# EAGLE design cistercianDisplay (EAGLE 9.6.2)
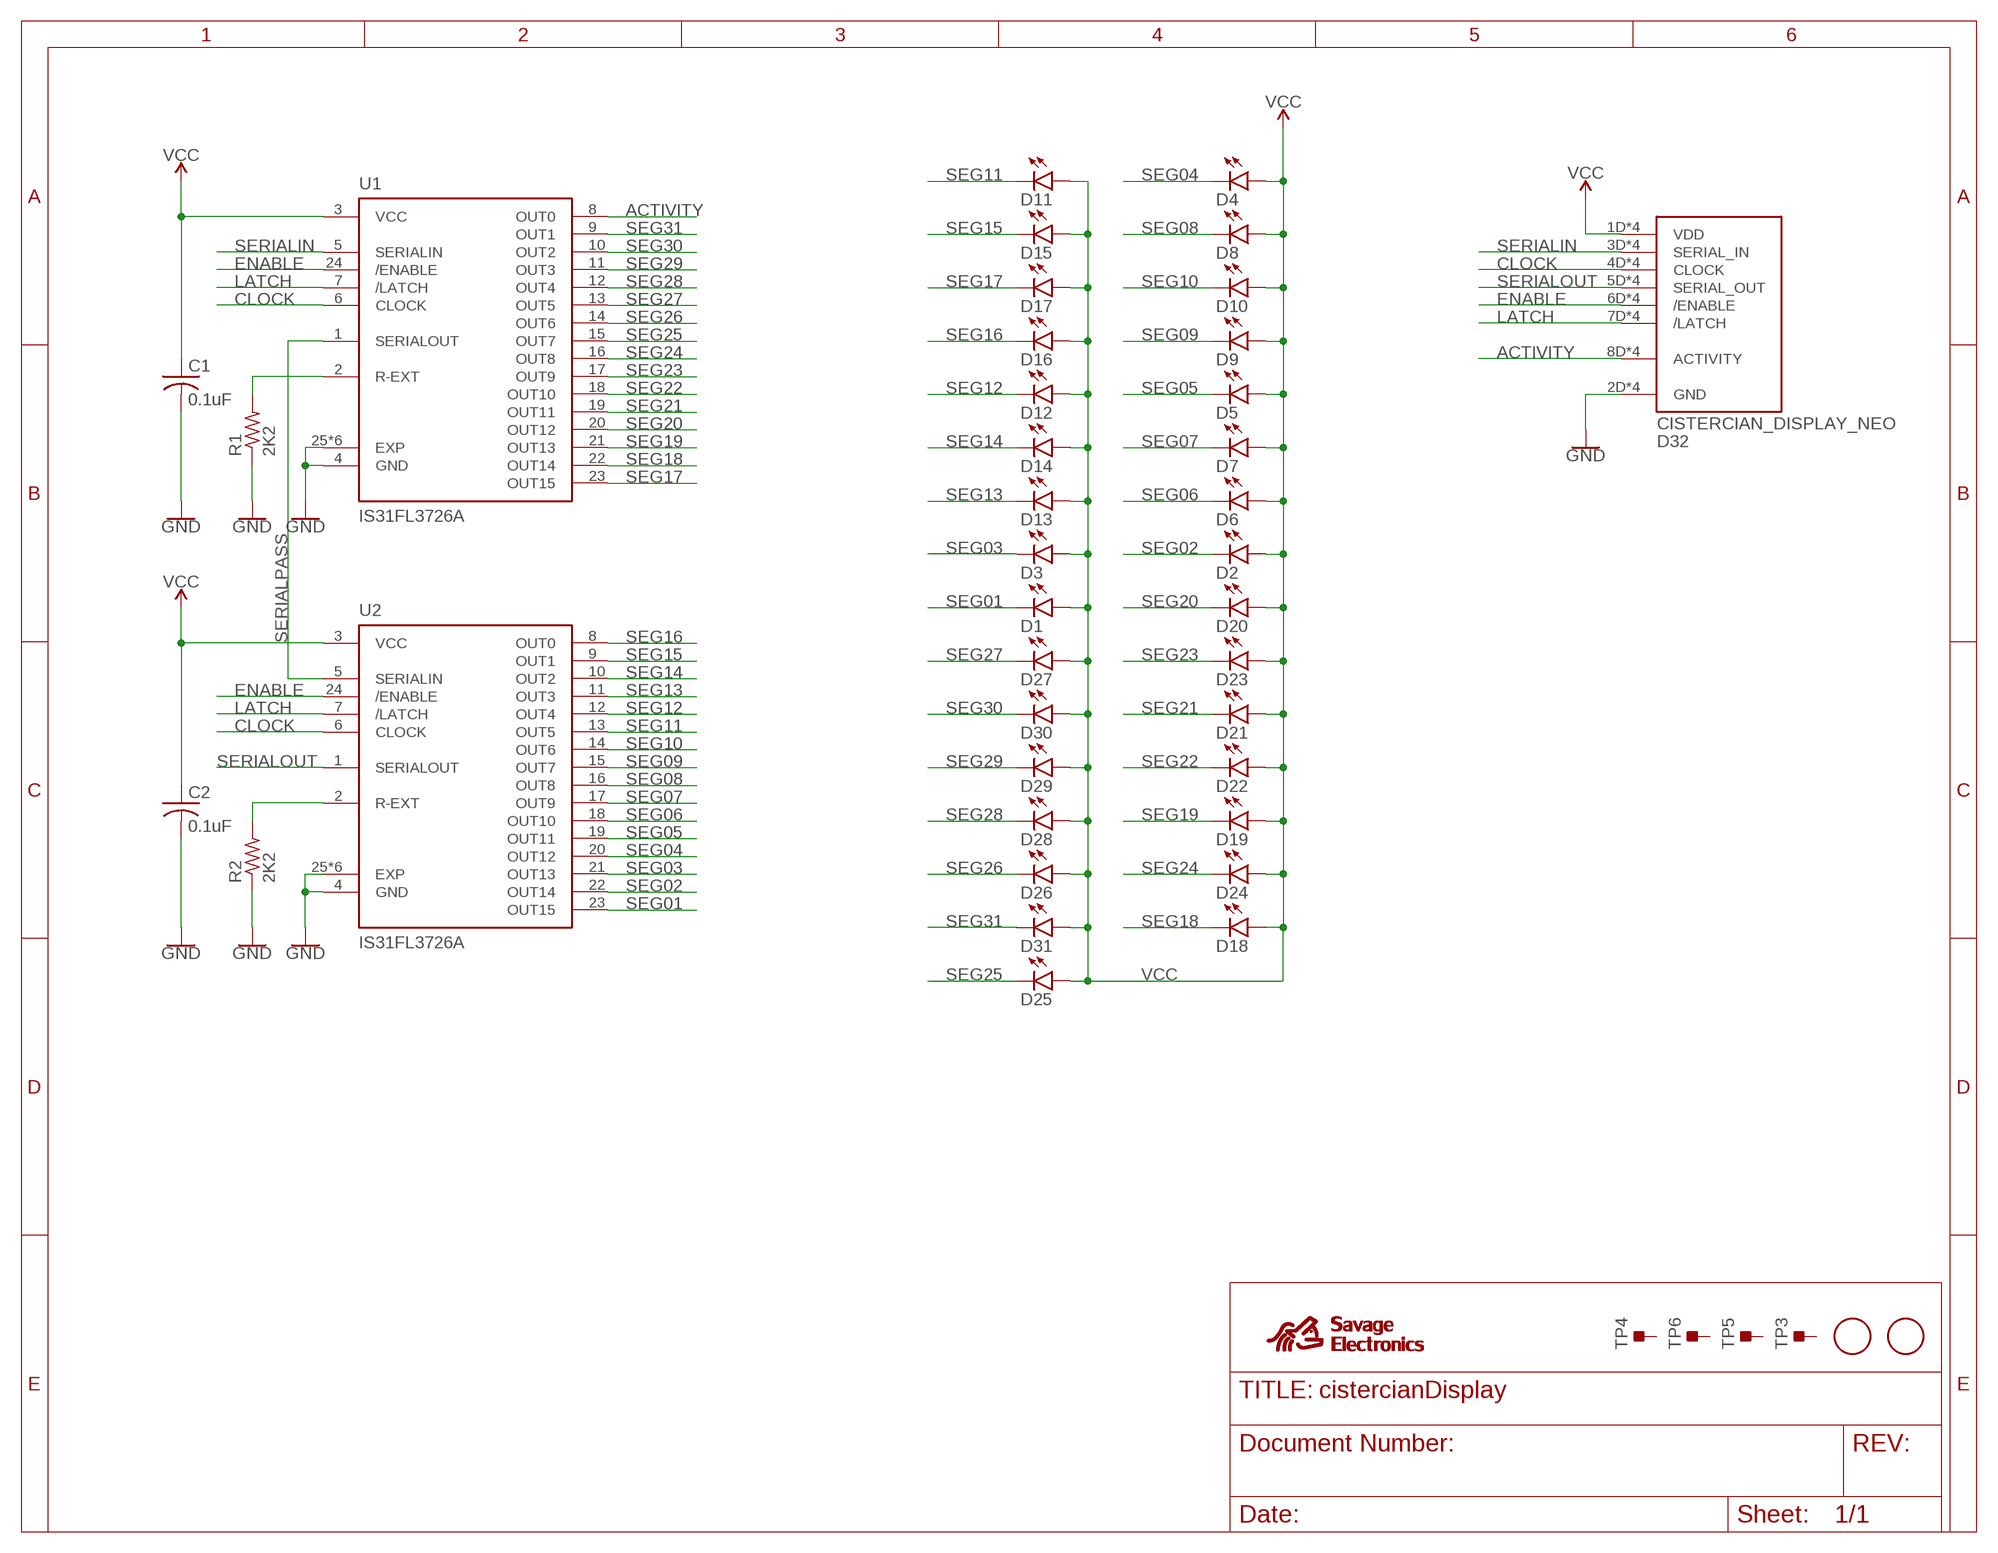
[diagram p0: schematic, sheet 1]

## Parts
C1  0.1uF  C-USC0603  [C0603]
C2  0.1uF  C-USC0603  [C0603]
D1  LEDCHIP-LED0805  [CHIP-LED0805]
D2  LEDCHIP-LED0805  [CHIP-LED0805]
D3  LEDCHIP-LED0805  [CHIP-LED0805]
D4  LEDCHIP-LED0805  [CHIP-LED0805]
D5  LEDCHIP-LED0805  [CHIP-LED0805]
D6  LEDCHIP-LED0805  [CHIP-LED0805]
D7  LEDCHIP-LED0805  [CHIP-LED0805]
D8  LEDCHIP-LED0805  [CHIP-LED0805]
D9  LEDCHIP-LED0805  [CHIP-LED0805]
D10  LEDCHIP-LED0805  [CHIP-LED0805]
D11  LEDCHIP-LED0805  [CHIP-LED0805]
D12  LEDCHIP-LED0805  [CHIP-LED0805]
D13  LEDCHIP-LED0805  [CHIP-LED0805]
D14  LEDCHIP-LED0805  [CHIP-LED0805]
D15  LEDCHIP-LED0805  [CHIP-LED0805]
D16  LEDCHIP-LED0805  [CHIP-LED0805]
D17  LEDCHIP-LED0805  [CHIP-LED0805]
D18  LEDCHIP-LED0805  [CHIP-LED0805]
D19  LEDCHIP-LED0805  [CHIP-LED0805]
D20  LEDCHIP-LED0805  [CHIP-LED0805]
D21  LEDCHIP-LED0805  [CHIP-LED0805]
D22  LEDCHIP-LED0805  [CHIP-LED0805]
D23  LEDCHIP-LED0805  [CHIP-LED0805]
D24  LEDCHIP-LED0805  [CHIP-LED0805]
D25  LEDCHIP-LED0805  [CHIP-LED0805]
D26  LEDCHIP-LED0805  [CHIP-LED0805]
D27  LEDCHIP-LED0805  [CHIP-LED0805]
D28  LEDCHIP-LED0805  [CHIP-LED0805]
D29  LEDCHIP-LED0805  [CHIP-LED0805]
D30  LEDCHIP-LED0805  [CHIP-LED0805]
D31  LEDCHIP-LED0805  [CHIP-LED0805]
D32  CISTERCIAN_DISPLAY_NEO  [CISTERCIAN_DISPLAYNEO]
R1  2K2  R-US_R0603  [R0603]
R2  2K2  R-US_R0603  [R0603]
TP3  TESTPOINT_TPS-SMD-10SN  [TESTPOINT_SMD-10SN]
TP4  TESTPOINT_TPS-SMD-10SN  [TESTPOINT_SMD-10SN]
TP5  TESTPOINT_TPS-SMD-10SN  [TESTPOINT_SMD-10SN]
TP6  TESTPOINT_TPS-SMD-10SN  [TESTPOINT_SMD-10SN]
U1  IS31FL3726A  [QFN50P400X400X90-25N]
U2  IS31FL3726A  [QFN50P400X400X90-25N]
U$1  FIDUCIAL  [FIDUCIAL_1MM]
U$2  FIDUCIAL  [FIDUCIAL_1MM]
U$3  SE_SMALL_STOP  [SE_SMALL_STOP]

## Nets
ACTIVITY: D32.8D(ACTIVITY) D32.8DC(ACTIVITY) D32.8U(ACTIVITY) D32.8UC(ACTIVITY) U1.8(OUT0)
CLOCK: D32.4D(CLOCK) D32.4DC(CLOCK) D32.4U(CLOCK) D32.4UC(CLOCK) U1.6(CLOCK) U2.6(CLOCK)
ENABLE: D32.6D(/ENABLE) D32.6DC(/ENABLE) D32.6U(/ENABLE) D32.6UC(/ENABLE) U1.24(/ENABLE) U2.24(/ENABLE)
GND: C1.2 C2.2 D32.2D(GND) D32.2DC(GND) D32.2U(GND) D32.2UC(GND) R1.1 R2.1 U1.4(GND) U1.25(EXP) U1.P$1(EXP) U1.P$2(EXP) U1.P$3(EXP) U1.P$4(EXP) U1.P$5(EXP) U2.4(GND) U2.25(EXP) U2.P$1(EXP) U2.P$2(EXP) U2.P$3(EXP) U2.P$4(EXP) U2.P$5(EXP)
LATCH: D32.7D(/LATCH) D32.7DC(/LATCH) D32.7U(/LATCH) D32.7UC(/LATCH) U1.7(/LATCH) U2.7(/LATCH)
N$39: R2.2 U2.2(R-EXT)
N$40: R1.2 U1.2(R-EXT)
SEG01: D1.C U2.23(OUT15)
SEG02: D2.C U2.22(OUT14)
SEG03: D3.C U2.21(OUT13)
SEG04: D4.C U2.20(OUT12)
SEG05: D5.C U2.19(OUT11)
SEG06: D6.C U2.18(OUT10)
SEG07: D7.C U2.17(OUT9)
SEG08: D8.C U2.16(OUT8)
SEG09: D9.C U2.15(OUT7)
SEG10: D10.C U2.14(OUT6)
SEG11: D11.C U2.13(OUT5)
SEG12: D12.C U2.12(OUT4)
SEG13: D13.C U2.11(OUT3)
SEG14: D14.C U2.10(OUT2)
SEG15: D15.C U2.9(OUT1)
SEG16: D16.C U2.8(OUT0)
SEG17: D17.C U1.23(OUT15)
SEG18: D18.C U1.22(OUT14)
SEG19: D19.C U1.21(OUT13)
SEG20: D20.C U1.20(OUT12)
SEG21: D21.C U1.19(OUT11)
SEG22: D22.C U1.18(OUT10)
SEG23: D23.C U1.17(OUT9)
SEG24: D24.C U1.16(OUT8)
SEG25: D25.C U1.15(OUT7)
SEG26: D26.C U1.14(OUT6)
SEG27: D27.C U1.13(OUT5)
SEG28: D28.C U1.12(OUT4)
SEG29: D29.C U1.11(OUT3)
SEG30: D30.C U1.10(OUT2)
SEG31: D31.C U1.9(OUT1)
SERIALIN: D32.3D(SERIAL_IN) D32.3DC(SERIAL_IN) D32.3U(SERIAL_IN) D32.3UC(SERIAL_IN) U1.5(SERIALIN)
SERIALOUT: D32.5D(SERIAL_OUT) D32.5DC(SERIAL_OUT) D32.5U(SERIAL_OUT) D32.5UC(SERIAL_OUT) U2.1(SERIALOUT)
SERIALPASS: U1.1(SERIALOUT) U2.5(SERIALIN)
VCC: C1.1 C2.1 D1.A D2.A D3.A D4.A D5.A D6.A D7.A D8.A D9.A D10.A D11.A D12.A D13.A D14.A D15.A D16.A D17.A D18.A D19.A D20.A D21.A D22.A D23.A D24.A D25.A D26.A D27.A D28.A D29.A D30.A D31.A D32.1D(VDD) D32.1DC(VDD) D32.1U(VDD) D32.1UC(VDD) U1.3(VCC) U2.3(VCC)
Unconnected: TP3.TP TP4.TP TP5.TP TP6.TP

## Library data of the parts
C1 C2 = Adafruit:C-US: CAPACITOR, American symbol
D1-D31 = Adafruit:LED: LED OSRAM: - CHIPLED LG R971, LG N971, LY N971, LG Q971, LY Q971, LO R971, LY R971 LH N974, LH R974 LS Q976, LO Q976, LY Q976 LO Q996 - Hyper CHIPLED LW Q18S LB Q993, LB Q99A, LB R99A - SideLED LS A670, LO A670, LY A670, LG A670, LP A670 LB A673, LV A673, LT A673, LW A673 LH A674 LY A675 LS A676, LA A676, LO A676, LY A676, LW A676 LS A679, LY A679, LG A679 - Hyper Micro SIDELED® LS Y876, LA Y876, LO Y876, LY Y876 LT Y87S - SmartLED LW L88C, LW L88S LB L89C, LB L89S, LG L890 LS L89K, LO L89K, LY L89K LS L896, LA L896, LO L896, LY L896 - TOPLED LS T670, LO T670, LY T670, LG T670, LP T670 LSG T670, LSP T670, LSY T670, LOP T670, LYG T670 LG T671, LOG T671, LSG T671 LB T673, LV T673, LT T673, LW T673 LH T674 LS T676, LA T676, LO T676, LY T676, LB T676, LH T676, LSB T676, LW T676 LB T67C, LV T67C, LT T67C, LS T67K, LO T67K, LY T67K, LW E67C LS E67B, LA E67B, LO E67B, LY E67B, LB E67C, LV E67C, LT E67C LW T67C LS T679, LY T679, LG T679 LS T770, LO T770, LY T770, LG T770, LP T770 LB T773, LV T773, LT T773, LW T773 LH T774 LS E675, LA E675, LY E675, LS T675 LS T776, LA T776, LO T776, LY T776, LB T776 LHGB T686 LT T68C, LB T68C - Hyper Mini TOPLED® LB M676 - Mini TOPLED Santana® LG M470 LS M47K, LO M47K, LY M47K Source: http://www.osram.convergy.de/
D32 = NRF52832PRO Footprint:CISTERCIAN_DISPLAY_NEO
R1 R2 = Adafruit:R-US_: RESISTOR, American symbol
TP3-TP6 = TestProbe_Long:TESTPOINT_TPS: TEST POINT PAD; BOM: EXCLUDE
U1 U2 = IS31FL3726A:IS31FL3726A: ARM Cortex-M0+ SAM D10D Microcontroller IC 32-Bit 48MHz 8KB (8K x 8) FLASH 24-QFN (4x4) Check availability <https://pricing.snapeda.com/parts/ATSAMD10D13A-MNT/Microchip/view-part?ref=eda>; AVAILABILITY: In Stock; DESCRIPTION: ARM® Cortex®-M0+ series Microcontroller IC 32-Bit Single-Core 48MHz 8KB (8K x 8) FLASH 24-QFN (4x4); MF: Microchip; MP: ATSAMD10D13A-MNT; PACKAGE: QFN-24 Microchip; PRICE: None; PURCHASE-URL: https://pricing.snapeda.com/search/part/ATSAMD10D13A-MNT/?ref=eda
U$1 U$2 = Adafruit:FIDUCIAL: For use by pick and place machines to calibrate the vision/machine, 1mm By microbuilder.eu
U$3 = SE_NEWLOGO:SE_SMALL_STOP

## Board
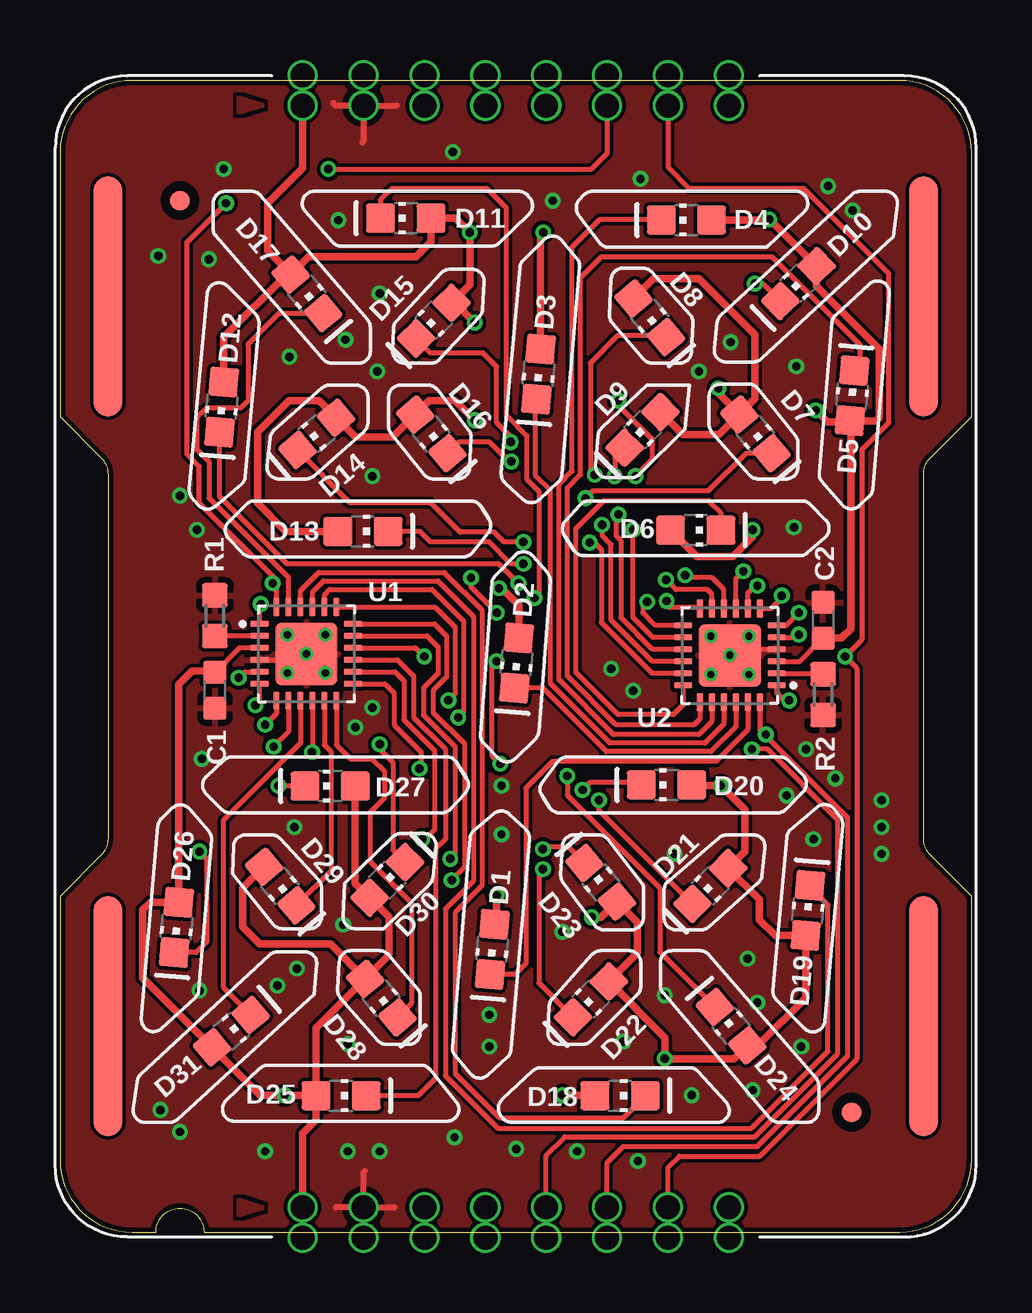
[diagram p1: board, top side]
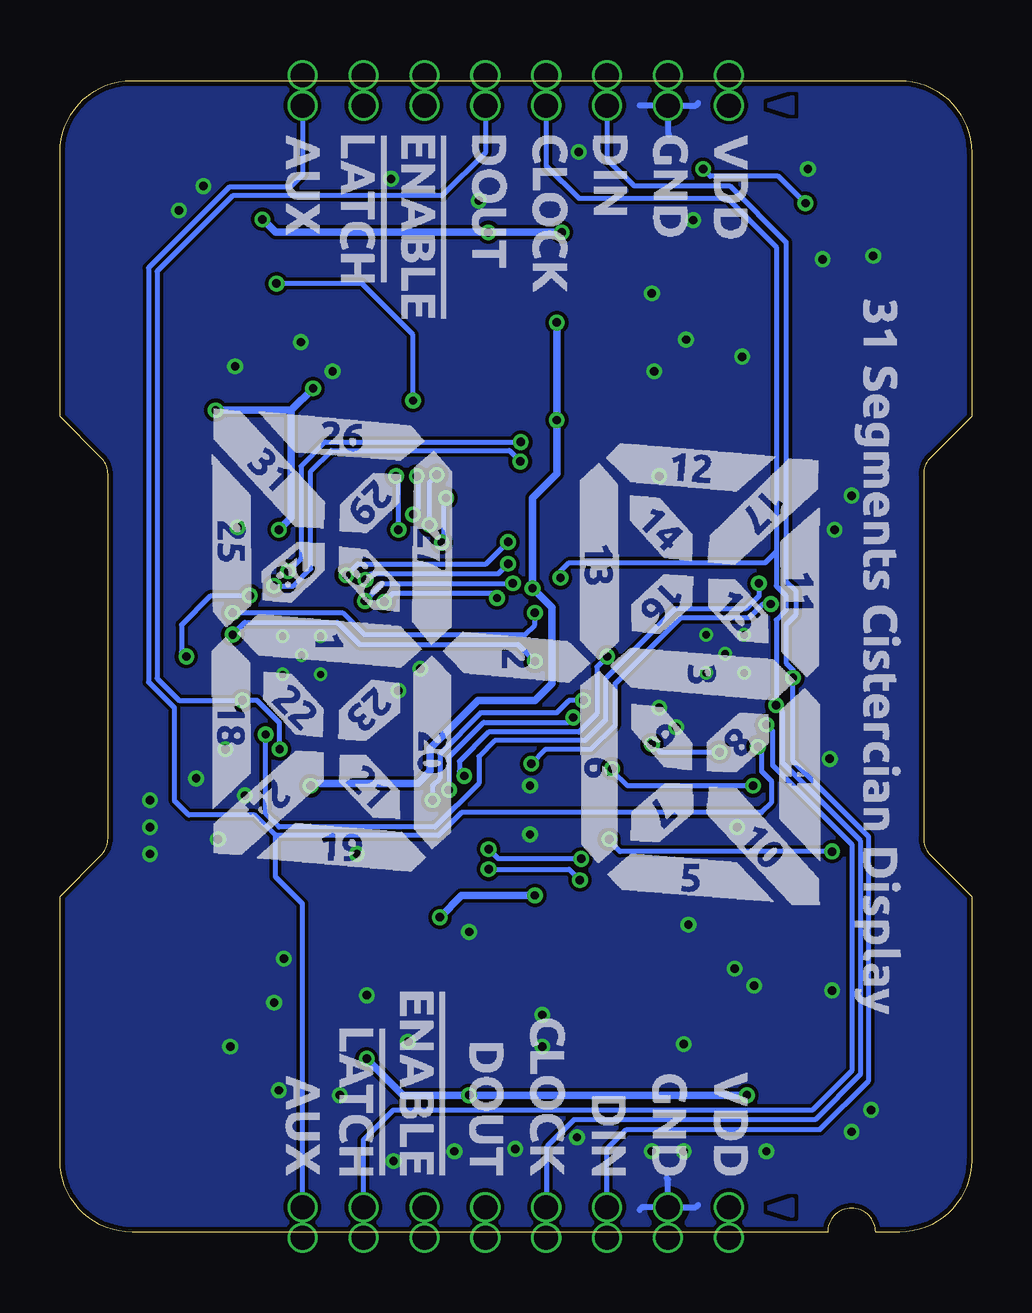
[diagram p2: board, bottom side, seen from below]

Size 38 x 48 mm. Coordinates in mm from the lower left corner, seen from the top.
Outline: 3,0 4,0 arc-90 5,1 arc-90 6,0 35,0 arc90 38,3 38,14 36.29,15.71 arc-45 36,16.41 36,31.59 arc-45 36.29,32.29 38,34 38,45 arc90 35,48 3,48 arc90 0,45 0,34 1.71,32.29 arc-45 2,31.59 2,16.41 arc-45 1.71,15.71 0,14 0,3 arc90 3,0
Copper layers (1*16): Top 0.035mm / dielectric 1.5mm / Bottom 0.035mm
Design rules "default *": minimum track width 6mil, minimum drill 0.3mm, track to track 6mil, track to pad 6mil, pad to pad 6mil, via to via 6mil, smd to smd 6mil, copper to edge 8mil, drill to drill 6mil, minimum pad ring 5mil, minimum via ring 6mil, stop-mask expansion 2mil, vias tented up to drill 20mil, thermal gap 10mil

### Footprints (pad centres in the part's own frame; a part is rotated, then mirrored left to right if it is on the bottom)
C0603 = smd 0.965 x 0.965: 1 -0.748,0; 2 0.748,0
CHIP-LED0805 = smd 1.2 x 1.2: A 0,-1.05; C 0,1.05
CISTERCIAN_DISPLAYNEO = drill 1: 1D -8.89,-22.962; 1DC -8.89,-24.232; 1U -8.89,24.232; 1UC -8.89,22.962; 2D -6.35,-22.962; 2DC -6.35,-24.232; 2U -6.35,24.232; 2UC -6.35,22.962; 3D -3.81,-22.962; 3DC -3.81,-24.232; 3U -3.81,24.232; 3UC -3.81,22.962; 4D -1.27,-22.962; 4DC -1.27,-24.232; 4U -1.27,24.232; 4UC -1.27,22.962; 5D 1.27,-22.962; 5DC 1.27,-24.232; 5U 1.27,24.232; 5UC 1.27,22.962; 6D 3.81,-22.962; 6DC 3.81,-24.232; 6U 3.81,24.232; 6UC 3.81,22.962; 7D 6.35,-22.962; 7DC 6.35,-24.232; 7U 6.35,24.232; 7UC 6.35,22.962; 8D 8.89,-22.962; 8DC 8.89,-24.232; 8U 8.89,24.232; 8UC 8.89,22.962
R0603 = smd 1 x 1.067: 1 -0.85,0; 2 0.85,0
TESTPOINT_SMD-10SN = smd 10 x 1.2: TP 0,0
QFN50P400X400X90-25N = smd 0.76 x 0.26: 1 -1.95,1.25; 2 -1.95,0.75; 3 -1.95,0.25; 4 -1.95,-0.25; 5 -1.95,-0.75; 6 -1.95,-1.25; 13 1.95,-1.25; 14 1.95,-0.75; 15 1.95,-0.25; 16 1.95,0.25; 17 1.95,0.75; 18 1.95,1.25 | smd 0.26 x 0.76: 7 -1.25,-1.95; 8 -0.75,-1.95; 9 -0.25,-1.95; 10 0.25,-1.95; 11 0.75,-1.95; 12 1.25,-1.95; 19 1.25,1.95; 20 0.75,1.95; 21 0.25,1.95; 22 -0.25,1.95; 23 -0.75,1.95; 24 -1.25,1.95 | smd 2.6 x 2.6: 25 0,0 | drill 0.3: P$1 -0.794,0.794; P$2 0.794,0.794; P$3 0.794,-0.794; P$4 -0.794,-0.794; P$5 0,0
FIDUCIAL_1MM = smd 0.813 x 0.813: 1 0,0

### Placement (x,y rotation side)
C1  6.46,22.59 270 top
C2  31.81,25.5 90 top
D1  18.02,11.79 175 top
D2  19.03,23.72 175 top
D3  19.95,35.76 175 top
D4  26.11,42.19 90 top
D5  33.02,34.86 355 top
D6  26.5,29.26 270 top
D7  28.99,33.27 220 top
D8  24.59,38.12 220 top
D9  24.28,33.44 135 top
D10  30.78,39.54 134 top
D11  14.41,42.27 90 top
D12  6.74,34.39 175 top
D13  12.63,29.21 270 top
D14  10.7,33.27 130 top
D15  15.58,38 135 top
D16  15.48,33.27 220 top
D17  10.3,39.12 220 top
D18  23.35,5.69 270 top
D19  31.18,13.41 355 top
D20  25.28,18.64 90 top
D21  27.11,14.43 135 top
D22  22.13,9.7 135 top
D23  22.54,14.58 40 top
D24  27.97,8.59 40 top
D25  11.72,5.69 270 top
D26  4.86,12.7 175 top
D27  11.26,18.59 90 top
D28  13.4,9.75 220 top
D29  9.18,14.43 220 top
D30  13.65,14.68 315 top
D31  7.15,8.38 310 top
D32  19,24 0 top
R1  6.46,25.69 270 top
R2  31.81,22.41 90 top
TP3  36,9 90 top
TP4  2,9 90 top
TP5  36,39 90 top
TP6  2,39 90 top
U1  10.27,24.11 0 top
U2  27.93,24.04 180 top
U$1  5,43 0 top
U$2  33,5 0 top
U$3  36,16 270 bottom

### Tracks (layer width: path | path; a pad name or v marks a point on that pad's centre or on a via)
ACTIVITY  (via drill 0.35)
  Top 0.203: U1.8 9.52,20.85 v8.91,20.23
  Top 0.254: D32.8UC D32.8U | D32.8D D32.8DC
  Bottom 0.203: v8.91,20.23 8.75,20.08 8.75,19.22 8.35,18.81 8.35,17.9 8.75,17.49 21.26,17.49 22.22,16.53 29.02,16.53 | D32.8UC 27.89,44.08 28.41,43.55 30.95,43.55 34.31,40.19 34.31,22.93 33.24,21.86 33.24,18 32.63,17.39 29.88,17.39 29.02,16.53 | 29.02,16.53 29.02,14.81 27.89,13.68 D32.8D
CLOCK  (via drill 0.35)
  Top 0.203: v8.14,21.96 8.32,22.14 U1.6 | U2.6 30.27,25.29 v30.8,25.82 | v18.2,25.82 17.14,26.88 v17.14,27.27
  Top 0.254: D32.4UC D32.4U | D32.4D D32.4DC
  Bottom 0.203: D32.4UC 17.73,44.45 16.37,43.09 10.18,43.09 8.14,41.06 8.14,28.36 | 8.14,28.36 8.14,26.94 7.74,26.53 7.74,25.92 8.14,25.52 v8.14,21.96 7.89,21.71 7.89,19.57 4.64,16.32 4.64,6.57 6.52,4.69 16.58,4.69 17.69,3.57 17.69,1.07 D32.4D | v30.8,25.82 26.23,25.82 25.31,24.91 18.61,24.91 18.2,25.31 v18.2,25.82 | v17.14,27.27 17.14,27.55 16.78,27.91 8.6,27.91 8.14,28.36
ENABLE  (via drill 0.35)
  Top 0.203: U2.24 29.18,20.94 29.33,20.79 | 29.33,20.79 32.83,17.29 32.83,7.33 29.07,3.57 23.49,3.57 22.81,2.9 D32.6D | U1.24 9.02,26.89 9.02,27.18 | v6.92,42.89 5.3,41.27 5.3,32.43 5.81,31.92 5.81,30.39 9.02,27.18 | v11.19,44.31 22.16,44.31 22.81,44.96 D32.6UC | v8.86,27.04 9.02,27.2 9.02,27.18 | v29.43,20.74 29.38,20.79 29.33,20.79
  Top 0.254: D32.6UC D32.6U | D32.6D D32.6DC
  Bottom 0.203: v6.92,42.89 8.04,44.01 10.89,44.01 v11.19,44.31 | v8.86,27.04 8.86,26.52 9.41,25.98 12.36,25.98 15.26,23.08 15.26,21.35 16.12,20.49 19.88,20.49 20.54,19.83 20.54,18.71 22.37,16.88 28.87,16.88 29.43,17.44 v29.43,20.74
GND  (via drill 0.35)
  Top 0.203: U1.4 10.02,23.86 U1.P$5 | U2.4 28.18,24.29 U2.P$5
  Top 0.254: D32.2UC 12.65,45.47 12.61,45.43 | D32.2UC 11.49,46.96 11.39,47.06 | D32.2UC 14.04,46.95 | D32.2D 12.65,2.49 12.72,2.56 | D32.2D 13.93,1.04 13.94,1.03 | D32.2D 11.5,1.03 | D32.2D D32.2DC
  Bottom 0.254: D32.2UC 12.65,45.77 12.61,45.74 | D32.2UC 11.49,46.96 11.39,47.06 | D32.2UC 13.83,46.95 | D32.2UC D32.2U | D32.2D 12.65,2.19 12.72,2.25 | D32.2D 13.73,1.04 13.83,0.93 | D32.2D 11.49,1.04 11.39,1.13
  other vias: 5.71,29.28 5.91,19.73 12.31,21.05 13.02,21.86 18.41,16.58 18.41,18.61 23.89,22.57 22.98,23.49 34.26,15.76 34.26,16.88 34.26,18 31.41,16.37 19.02,3.47 17.9,9.06 17.9,7.74 9.06,10.28 9.87,10.99 23.49,7.94 28.67,11.4 9.57,36.49 13.33,39.13 16.37,45.02 20.54,42.99 32.02,43.6 33.04,42.59 30.7,36.08 26.64,35.88 30.6,29.38 13.02,31.51 16.45,3.95 12,7.84 9.77,16.88 25.62,15.76 29.07,9.57 25.21,9.87 20.95,12.51 11.8,12.82 5.81,10.07 24.2,43.91 32.32,18.91 31.11,20.13 30.29,18.2 30.9,7.74 26.33,5.71 28.87,5.91 4.99,4.18 4.18,5.1 4.99,30.7 6.21,40.55 4.1,40.69 6.82,44.31 21.56,3.37 24.1,2.96 13.33,3.37 12,3.37 8.55,3.37 13.22,35.88 11.9,37.2 11.6,42.18 27.96,37.1
  pour Top (rank 2): 0,45 0,3 arc90 3,0 4,0 arc-90 5,1 arc-90 6,0 35,0 arc90 38,3 38,45 arc90 35,48 3,48 arc90
  pour Bottom (rank 2): 0,45 0,3 arc90 3,0 4,0 arc-90 5,1 arc-90 6,0 35,0 arc90 38,3 38,45 arc90 35,48 3,48 arc90
LATCH  (via drill 0.35)
  Top 0.203: U2.7 29.65,25.99 30.09,26.43 v30.09,26.53 | D32.7UC 25.35,44.38 26.23,43.5 31,43.5 34.56,39.95 34.56,33.75 33.44,32.63 33.44,24.7 v32.73,23.99 33.24,23.49 33.24,7.23 29.18,3.17 25.82,3.17 25.35,2.69 D32.7D | U1.7 9.02,21.62 v8.55,21.15
  Top 0.254: D32.7UC D32.7U | D32.7D D32.7DC
  Bottom 0.203: v32.73,23.99 32.93,24.2 32.93,25.31 31.71,26.53 v30.09,26.53 | v8.55,21.15 8.3,20.89 8.3,19.47 4.99,16.17 4.99,6.72 6.62,5.1 24.09,5.1 25.35,3.84 D32.7D
N$1
  pour Bottom: 7.47,46.65 7.47,47.3 8.46,46.97
  pour Top: 7.47,46.65 7.47,47.3 8.46,46.97
N$6
  pour Bottom: 7.47,0.7 7.47,1.35 8.46,1.02
  pour Top: 7.47,0.7 7.47,1.35 8.46,1.02
N$39
  Top 0.203: U2.2 31.77,23.29 R2.2
N$40
  Top 0.203: U1.2 6.47,24.86 R1.2
SEG01
  Top 0.203: U2.23 28.68,20.95 27.35,19.62 20.54,19.62 19.42,18.51 19.42,11.19 18.97,10.74 D1.C
SEG02
  Top 0.203: U2.22 28.18,21.06 27.14,20.03 22.77,20.03 20.13,22.68 D2.C
SEG03
  Top 0.203: U2.21 27.68,21.17 26.89,20.39 22.93,20.39 20.44,22.88 20.44,30.9 19.83,31.51 19.83,34.56 19.86,34.59 D3.C
SEG04
  Top 0.203: U2.20 27.18,21.28 26.64,20.74 23.08,20.74 20.79,23.03 20.79,31.16 21.35,31.72 21.35,41.06 22.5,42.22 25.04,42.22 D4.C
SEG05
  Top 0.203: U2.19 26.68,21.39 26.43,21.15 23.18,21.15 21.15,23.18 21.15,31.01 21.71,31.57 21.71,39.79 22.57,40.66 29.68,40.66 33.35,36.99 33.35,36.19 33.35,36.15 D5.C
SEG06
  Top 0.203: U2.18 25.98,21.98 25.57,21.57 23.26,21.57 21.5,23.33 21.5,29.33 22.67,30.5 27.04,30.5 27.55,29.99 D6.C
SEG07  (via drill 0.35)
  Top 0.203: U2.17 24.69,23.29 22.57,25.42 22.57,28.46 22.29,28.74 v22.09,28.74 | v21.91,30.6 22.21,30.9 27.04,30.9 28.61,32.47 D7.C
  Bottom 0.203: v21.91,30.6 22.01,30.5 22.01,28.82 v22.09,28.74
SEG08  (via drill 0.35)
  Top 0.203: U2.16 24.7,23.79 22.98,25.52 22.98,28.67 22.6,29.05 v22.6,29.48 | v22.29,31.56 22.11,31.74 22.11,36.23 23.25,37.37 25.22,37.37 25.22,37.35 D8.C
  Bottom 0.203: v22.6,29.48 22.6,31.26 v22.29,31.56
SEG09  (via drill 0.35)
  Top 0.203: U2.15 24.7,24.29 23.38,25.61 23.38,28.82 23.18,29.03 23.18,29.81 v23.28,29.91 | v23.13,31.51 23.13,32.29 D9.C
  Bottom 0.203: v23.28,29.91 23.08,30.12 23.08,31.46 v23.13,31.51
SEG10  (via drill 0.35)
  Top 0.203: U2.14 24.72,24.79 23.89,25.62 v23.89,29.28 | v23.99,31.51 24.7,32.22 24.7,33.04 23.28,34.46 v23.28,34.66 | v28.97,39.54 29.3,39.54 D10.C
  Bottom 0.203: v23.89,29.28 23.89,31.41 v23.99,31.51 | v23.28,34.66 23.28,37.41 25.42,39.54 v28.97,39.54
SEG11  (via drill 0.35)
  Top 0.203: U2.13 24.82,25.29 24.3,25.82 24.3,26.1 v24.47,26.28 | v19.78,26.43 19.98,26.63 19.98,30.86 19.47,31.37 19.47,33.19 18.61,34.05 18.61,42.69 17.8,43.5 13.83,43.5 13.36,43.03 D11.C
  Bottom 0.203: v19.78,26.43 19.98,26.64 24.12,26.64 v24.47,26.28
SEG12  (via drill 0.35)
  Top 0.203: U2.12 26.64,26.03 25.42,26.03 25.29,26.15 v25.29,26.3 | v19.12,27.04 18.3,27.85 9.46,27.85 6.65,30.67 D12.C
  Bottom 0.203: v25.29,26.3 24.55,27.04 v19.12,27.04
SEG13  (via drill 0.35)
  Top 0.203: U2.11 27.18,26.6 26.99,26.79 25.67,26.79 v25.26,27.19 | v19.32,27.85 18.81,27.85 17.9,28.77 15.45,28.77 15,29.21 D13.C
  Bottom 0.203: v25.26,27.19 25.01,27.45 19.73,27.45 v19.32,27.85
SEG14  (via drill 0.35)
  Top 0.203: U2.10 27.68,26.79 27.18,27.28 26.16,27.28 v26.06,27.38 | v19.32,28.77 18.51,28.77 18.1,29.18 16.68,29.18 15.46,30.39 12.1,30.39 D14.C
  Bottom 0.203: v26.06,27.38 25.59,27.85 20.23,27.85 v19.32,28.77
SEG15  (via drill 0.35)
  Top 0.203: U2.9 28.18,27.24 v28.49,27.55 | v18.79,32.93 18.79,33.16 18.2,33.75 18.2,36.08 17.64,36.65 15.45,36.65 D15.C
  Bottom 0.203: v28.49,27.55 27.96,28.08 27.96,31.92 26.94,32.93 v18.79,32.93
SEG16  (via drill 0.35)
  Top 0.203: U2.8 28.68,26.64 28.97,26.94 v29.07,26.94 | v18.81,32.12 18.71,32.12 17.9,32.93 16.62,32.93 D16.C
  Bottom 0.203: v29.07,26.94 28.26,26.94 27.55,27.65 27.55,31.72 26.69,32.58 19.27,32.58 v18.81,32.12
SEG17
  Top 0.203: U1.23 9.52,27.29 6.21,30.6 6.21,32.12 5.71,32.63 5.71,33.95 6.11,34.36 7.53,34.36 7.84,34.66 7.84,37.01 9.14,38.31 D17.C
SEG18
  Top 0.203: U1.22 10.02,26.73 10.79,27.5 16.02,27.5 17.59,25.92 17.59,14.44 16.48,13.33 16.48,6.62 18.32,4.78 23.49,4.78 D18.C
SEG19
  Top 0.203: U1.21 10.52,26.68 10.99,27.14 15.76,27.14 17.24,25.67 17.24,14.65 16.07,13.48 16.07,6.52 18.26,4.33 28.82,4.33 32.02,7.53 32.02,13.63 31.27,14.38 D19.C
SEG20  (via drill 0.35)
  Top 0.203: U1.20 11.02,26.57 11.24,26.79 15.52,26.79 16.83,25.47 16.83,21.68 v16.6,21.45 | v21.78,18.43 22.1,18.75 24.13,18.75 D20.C
  Bottom 0.203: v16.6,21.45 16.8,21.25 20.34,21.25 21.78,19.8 v21.78,18.43
SEG21  (via drill 0.35)
  Top 0.2: 16.48,24.7 16.48,22.44 v16.2,22.16 | 22.47,17.58 v22.47,18
  Top 0.203: U1.19 15.63,26.06 16.48,25.21 16.48,24.7 | D21.C 22.47,17.58
  Bottom 0.2: v16.2,22.16 16.78,22.16 17.29,21.66 20.44,21.66 22.16,19.93 22.16,18.91 22.47,18.61 v22.47,18
SEG22  (via drill 0.35)
  Top 0.2: U1.18 15.62,25.36 16.12,24.86 16.12,24.56 16.12,23.13 15.56,22.57 15.56,21.66 16.86,20.36 16.86,15.21 v16.33,14.67 | 19.97,10.38 19.97,14.96 v20.13,15.13
  Top 0.203: 19.97,10.38 D22.C
  Bottom 0.2: v16.33,14.67 16.78,15.13 v20.13,15.13
SEG23  (via drill 0.35)
  Top 0.2: U1.17 15.31,24.86 15.76,24.4 15.76,23.28 15.15,22.67 15.15,21.55 16.48,20.23 16.48,15.76 v16.27,15.56 | v20.13,15.97 20.23,16.07 21.18,16.07
  Top 0.203: 21.18,16.07 D23.C
  Bottom 0.2: v16.27,15.56 19.73,15.56 v20.13,15.97
SEG24  (via drill 0.35)
  Top 0.2: U1.16 14.82,24.36 v15.18,23.99 | v21.15,19.02 21.15,18.2 25.01,14.34 25.01,11.68
  Top 0.203: 25.01,11.68 D24.C
  Bottom 0.2: v15.18,23.99 15.62,23.56 15.62,21.6 16.37,20.84 20.13,20.84 21.35,19.62 21.35,19.22 v21.15,19.02
SEG25
  Top 0.2: U1.15 14.07,23.86 14.75,23.18 14.75,21.45 16.07,20.13 16.07,16.37 15.66,15.97 15.66,6.42 14.94,5.69
  Top 0.203: 14.94,5.69 D25.C
SEG26  (via drill 0.35)
  Top 0.2: U1.14 13.96,23.36 14.34,22.98 14.34,21.35 15.62,20.08 15.62,16.78 15.21,16.37 v15.11,16.37 | v5.81,15.87 6.11,15.56 6.11,12.08 5.68,11.65
  Top 0.203: 5.68,11.65 D26.C
  Bottom 0.2: v5.81,15.87 14.65,15.87 15.11,16.33 v15.11,16.37
SEG27  (via drill 0.35)
  Top 0.2: U1.13 13.55,22.86 13.94,22.47 13.94,21.15 15.06,20.02 15.06,19.52 15.04,19.5 15.04,19.37 v14.98,19.32
  Top 0.203: D27.C 9.12,18.59 v9.11,18.61
  Bottom 0.2: v14.98,19.32 14.98,19.25 14.34,18.61 v9.11,18.61
SEG28
  Top 0.2: U1.12 11.52,20.31 12.11,19.73 13.02,19.73 13.53,19.22 13.53,18.1 12.92,17.49 12.92,15.46 14.65,13.73 14.65,9.53
  Top 0.203: 14.65,9.53 D28.C
SEG29
  Top 0.2: U1.11 11.02,20.3 11.29,20.03 11.29,15.06
  Top 0.203: 11.29,15.06 D29.C
SEG30  (via drill 0.35)
  Top 0.2: U1.10 10.52,20.02 v10.51,20.01 | 13.88,15.93 13.88,19.57 13.33,20.13 v13.33,20.34
  Top 0.203: 13.88,15.93 D30.C
  Bottom 0.2: v10.51,20.01 12.99,20.01 v13.33,20.34
SEG31
  Top 0.2: U1.9 10.02,20.38 6.82,17.19 6.82,10.19
  Top 0.203: D31.C 6.82,10.19
SERIALIN  (via drill 0.35)
  Top 0.203: v7.45,23.11 7.7,23.36 U1.5
  Top 0.254: D32.3UC D32.3U | D32.3D D32.3DC
  Bottom 0.203: D32.3UC 15.19,44.73 14.07,43.61 10.08,43.61 7.74,41.27 7.74,27.14 7.33,26.74 7.33,25.72 7.74,25.31 7.74,23.73 7.45,23.43 v7.45,23.11 7.45,19.64 4.28,16.48 4.28,6.32 6.32,4.28 14.38,4.28 15.19,3.47 D32.3D
SERIALOUT  (via drill 0.35)
  Top 0.203: v30.39,22.16 30.19,22.16 29.88,22.48 U2.1 | D32.5D 20.27,3.2 21.05,3.98 28.97,3.98 32.43,7.43 32.43,17.19 29.48,20.13 v28.84,20.13
  Top 0.254: D32.5UC D32.5U | D32.5D D32.5DC
  Bottom 0.203: D32.5UC 20.27,44.99 22.06,43.2 30.8,43.2 33.95,40.05 33.95,23.08 33.04,22.16 v30.39,22.16 29.79,22.16 28.84,21.23 v28.84,20.13
SERIALPASS  (via drill 0.35)
  Top 0.203: U2.5 30.69,24.79 v30.8,24.91 | v18.2,23.79 18.2,23.77 18,23.57 18,19.88 v18.35,19.52 | U1.1 8.32,26.13 v8.37,26.18
  Bottom 0.203: v30.8,24.91 30.29,25.42 26.43,25.42 25.52,24.5 18.91,24.5 v18.2,23.79 | v8.37,26.18 8.7,26.18 9.26,25.62 12.11,25.62 14.85,22.88 14.85,21.15 15.87,20.13 17.74,20.13 v18.35,19.52
VCC  (via drill 0.35)
  Top 0.203: U2.3 30.85,23.79 C2.1 | U1.3 7.48,24.36 C1.1 | D20.A 26.37,18.61 | D18.A 22.29,5.71 | D15.A 16.46,38.74 | D1.A 18.2,12.92 | D25.A 10.65,5.71
  Top 0.254: D32.1UC D32.1U | D32.1D D32.1DC
  Top 0.305: D32.1UC 10.11,44.35 8.65,42.89 8.65,40.91 9.54,40.02 9.44,39.92 | v20.14,41.67 20.04,41.57 D3.A | D7.A 28.97,34.73 28.97,37.41 26.64,39.74 24.73,39.74 D8.A | v18.3,26.84 18.41,26.84 19.13,26.12 D2.A | 26.37,18.61 v27.55,18.61 28.55,17.61 28.55,15.87 D21.A 29.16,13.86 29.16,13.02 29.82,12.37 D19.A 31.08,9.76 29.1,7.78 D24.A 28.1,7.23 v25.21,7.23 25.21,8.11 D22.A 24.08,11.65 24.08,12.91 D23.A 22.56,13.12 v22.16,13.12 | 22.29,5.71 v20.95,5.71 | 18.2,12.92 v18.2,14.04 | 10.65,5.71 v9.36,5.71 8.34,5.71 D31.A 3.45,10.6 3.45,13.43 3.77,13.75 D26.A 4.95,22.83 5.5,23.38 6.41,23.38 C1.1 | C2.1 32.58,24.76 32.96,25.14 32.96,33.78 D5.A | 16.46,38.74 v17.29,37.91 | v17.29,33.85 16.48,34.66 15.39,34.66 D16.A 13.86,33.14 12.32,33.14 D14.A 10.79,34.66 9.55,34.66 8.23,33.34 8.23,30.39 9.41,29.21 D13.A | v31.51,34.26 32.01,33.76 32.87,33.76 D5.A | v27.45,35.17 27.45,34.97 28.32,34.1 | 28.32,34.1 D7.A | v28.87,29.28 28.87,28.97 28.06,28.16 26.55,28.16 D6.A | D32.1D 10.11,4.12 10.67,4.67 D25.A 10.67,8.51 D28.A | D4.A 29.53,42.19 | 29.53,42.19 v29.56,42.22 | 29.53,42.19 29.62,42.19 D10.A 31.54,39.42 34.15,36.81 34.15,33.95 34.01,33.8 32.94,33.8 D5.A | D7.A 28.32,34.1 | D7.A | D9.A 25.97,33.24 27.48,33.24 D7.A | D15.A 17.09,39.5 v17.09,41.67 16.49,42.27 D11.A 15.46,41.28 14.83,40.66 10.36,40.66 D17.A 9.44,39.92 | D27.A 12.31,14.53 D30.A 13.72,13.13 13.72,11.55 D28.A | D28.A 11.27,12.01 8.33,12.01 7.62,12.72 7.62,14.35 D29.A | D12.A 6.83,37.31 9.44,39.92
  Bottom 0.305: v25.21,7.23 23.69,5.71 v20.95,5.71 v9.36,5.71 | v18.2,14.04 21.25,14.04 v22.16,13.12 | v17.29,37.91 v17.29,33.85 17.29,31.61 18.3,30.6 v18.3,26.84 17.49,26.03 17.49,22.88 18.2,22.16 20.57,22.16 22.57,20.17 22.57,19.22 23.08,18.71 27.45,18.71 v27.55,18.61 | v31.51,34.26 28.36,34.26 | 28.36,34.26 v27.45,35.17 | v17.09,41.67 v20.14,41.67 29.02,41.67 v29.56,42.22 | 28.36,34.26 28.36,29.79 v28.87,29.28